# Altium schematic sheet NFC_Controller.SchDoc
size A4; SheetNumber: 3; SheetTotal: 3
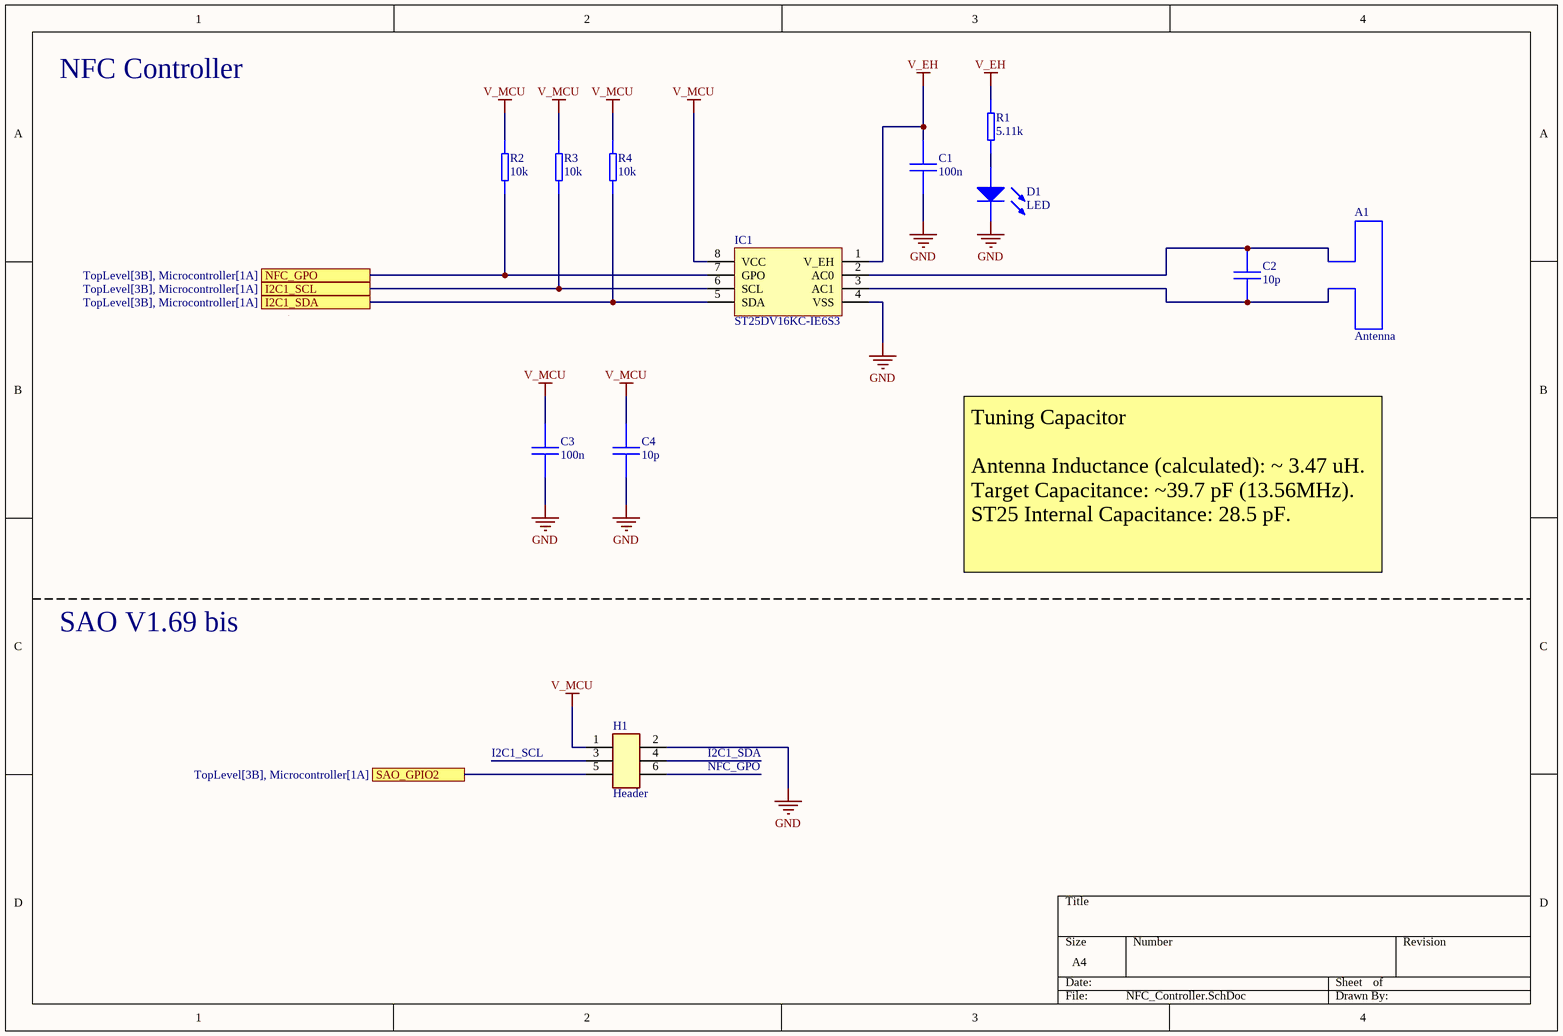
[diagram p0: NFC_Controller.SchDoc]

## Parts
A1  Antenna  [NFC Antenna 45 x 37]  (net tie, no BOM)
C1  100n  [CAP0805]
C2  10p  [CAP0402]
C3  100n  [CAP0805]
C4  10p  [CAP0402]
D1  LED  [LEDM2012X80N]
H1  Header  [HEADER_2X3]
IC1  ST25DV16KC-IE6S3  [SOIC8]
R1  5.11k  [RESC0805]
R2  10k  [RESC0805]
R3  10k  [RESC0805]
R4  10k  [RESC0805]

## Ports
I2C1_SCL (see TopLevel[3B], Microcontroller[1A]), I2C1_SDA (see TopLevel[3B], Microcontroller[1A]), NFC_GPO (see TopLevel[3B], Microcontroller[1A]), SAO_GPIO2 (see TopLevel[3B], Microcontroller[1A])

## Nets
GND: C1.2 C3.2 C4.2 D1.1(K) H1.2 IC1.4(VSS)
V_EH: C1.1 IC1.1(V_EH) R1.1
V_MCU: C3.1 C4.1 H1.1 IC1.8(VCC) R2.1 R3.1 R4.1
I2C1_SCL: IC1.6(SCL) R3.2 ; port I2C1_SCL
I2C1_SDA: IC1.5(SDA) R4.2 ; port I2C1_SDA
NFC_GPO: IC1.7(GPO) R2.2 ; port NFC_GPO
SAO_GPIO2: H1.5 ; port SAO_GPIO2
NetA1_1: A1.1 C2.1 IC1.2(AC0)
NetA1_2: A1.2 C2.2 IC1.3(AC1)
NetD1_2: D1.2(A) R1.2

Not connected (* = marked no-connect by the designer): H1 3 4 6

## Notes on the sheet
- NFC Controller
- Tuning Capacitor
  Antenna Inductance (calculated): ~ 3.47 uH.
  Target Capacitance: ~39.7 pF (13.56MHz).
  ST25 Internal Capacitance: 28.5 pF.
- SAO V1.69 bis
- I2C1_SCL
- I2C1_SDA
- NFC_GPO

## Library data of the parts
A1 = Antenna - Dual Ended 2: Antenna - Dual Ended
C1 C3 = Capacitor - Non Polarized: Non Polarized Capacitor
C2 C4 = Capacitor - Non Polarized_1: Non Polarized Capacitor
D1 = LED: General Purpose LED; ComponentLink1Description: Datasheet; ComponentLink1URL: https://www.smc-diodes.com/propdf/1N4148W%20N0571%20REV.E.pdf
H1 = 6-Pin Header (3x2): 6-Pin 2 Row Header
IC1 = ST25DV16KC-IE6S3: Integrated Circuit; Manufacturer_Name: STMicroelectronics; Datasheet Link: https://www.st.com/resource/en/datasheet/st25dv04kc.pdf; Height: 1.75mm; Manufacturer_Part_Number: ST25DV16KC-IE6S3; Mouser Part Number: 511-ST25DV16KC-IE6S3; Mouser Price/Stock: https://www.mouser.co.uk/ProductDetail/STMicroelectronics/ST25DV16KC-IE6S3?qs=QNEnbhJQKvbFHl9iSDOFGA%3D%3D; Arrow Part Number: ST25DV16KC-IE6S3; Arrow Price/Stock: https://www.arrow.com/en/products/st25dv16kc-ie6s3/stmicroelectronics?region=nac
R1 = Resistor_1: Resistor
R2-R4 = Resistor_2: Resistor